# EAGLE design devboard-rs485 (EAGLE 5.11)
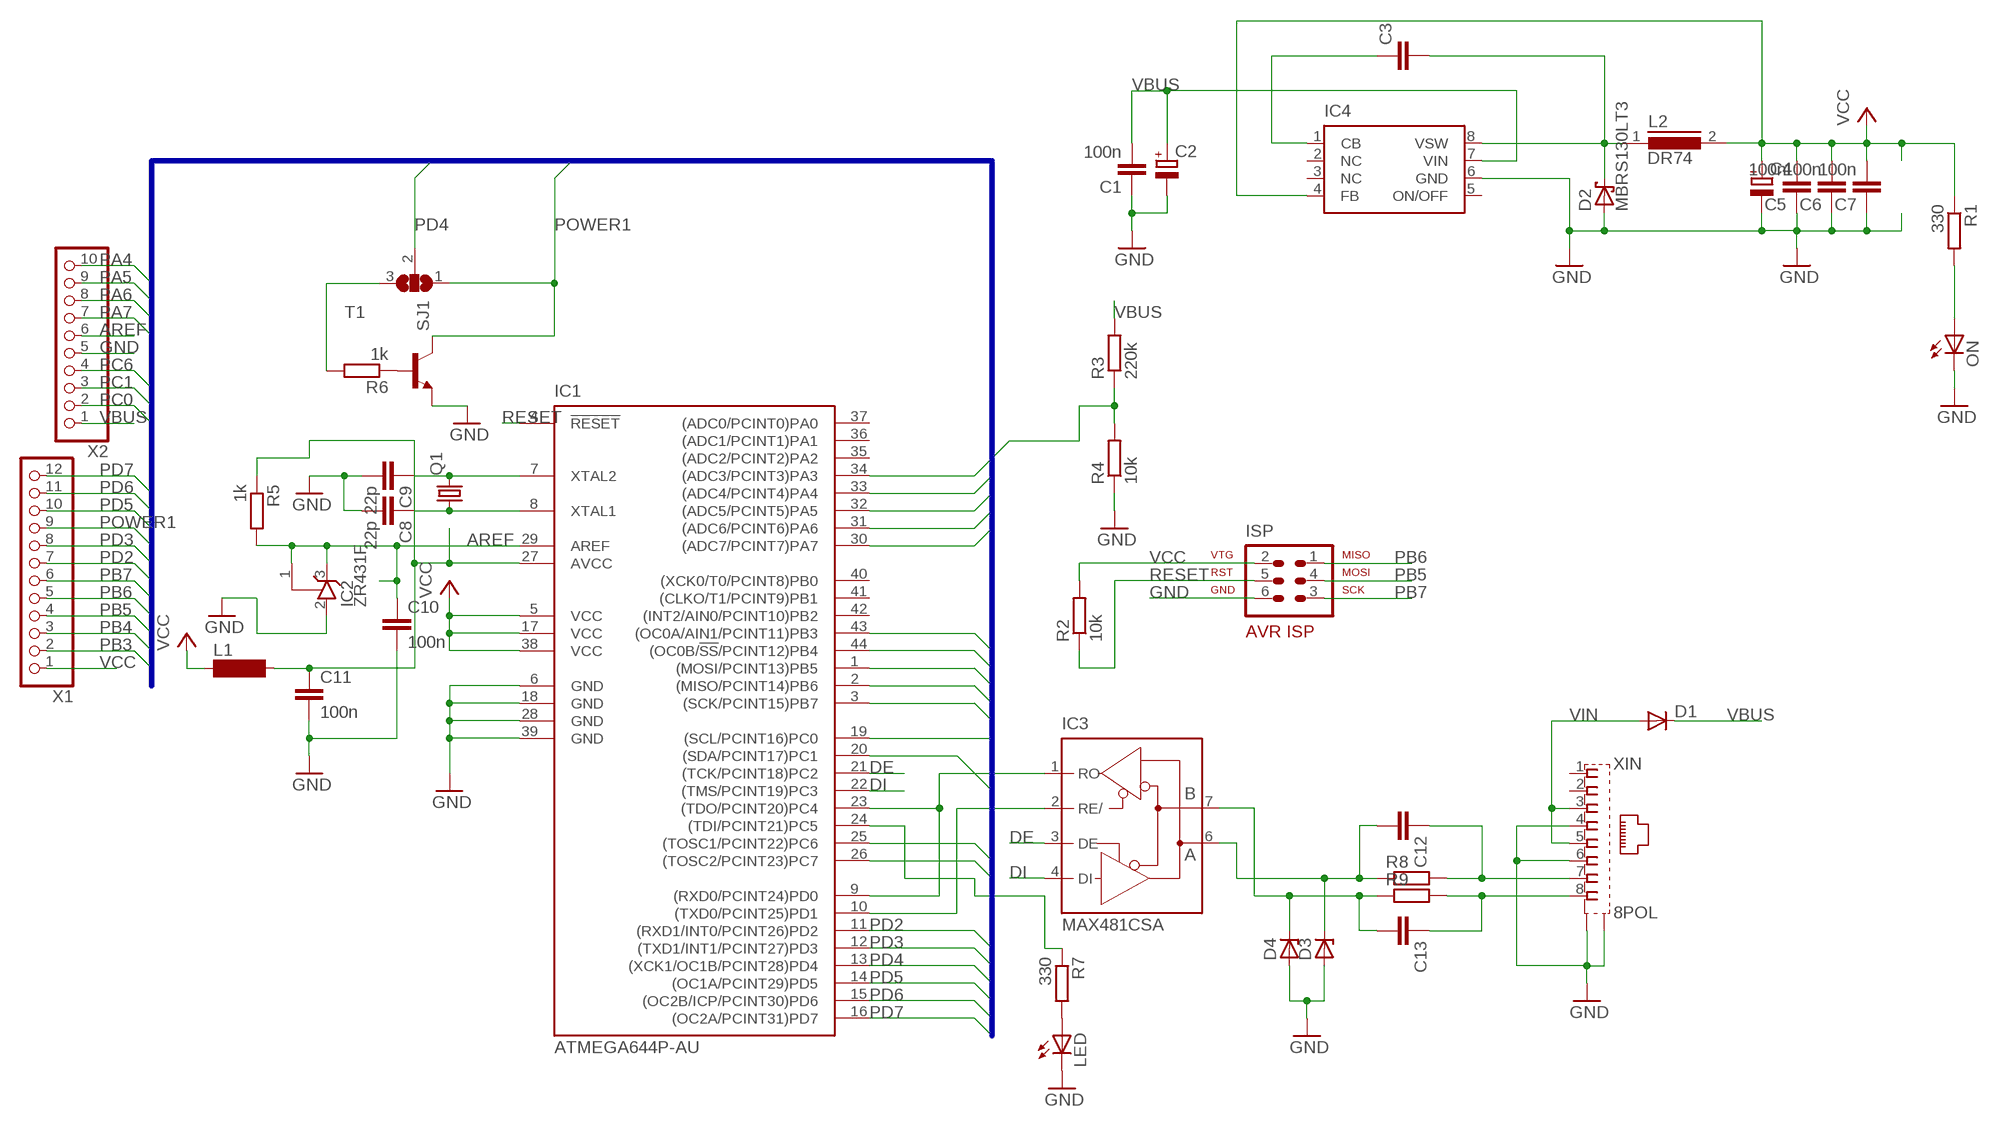
[diagram p0: schematic, sheet 1]

## Parts
C1  100n  C-EUC0805K  [C0805K]
C2  CPOL-EUE2.5-6  [E2,5-6]
C3  C-EUC0805K  [C0805K]
C4  CPOL-EUE2.5-6  [E2,5-6]
C5  100n  C-EUC0805K  [C0805K]
C6  100n  C-EUC0805K  [C0805K]
C7  100n  C-EUC0805K  [C0805K]
C8  22p  C-EUC0805K  [C0805K]
C9  22p  C-EUC0805K  [C0805K]
C10  100n  C-EUC0805K  [C0805K]
C11  100n  C-EUC0805K  [C0805K]
C12  C-EUC0805K  [C0805K]
C13  C-EUC0805K  [C0805K]
D1  DIODE-DO214BA  [DO214BA]
D2  MBRS130LT3  [SMB]
D3  ZENER-DIODESOD80C  [SOD80C]
D4  ZENER-DIODESOD80C  [SOD80C]
IC1  ATMEGA644P-AU  MEGA164P/324P/644P-AU  [TQFP44]
IC2  ZR431F  [SOT32]
IC3  MAX481CSA  [SO08]
IC4  LM2674  [SO8]
ISP  AVR-ISP-6  [AVR-ISP-6]
L1  SM-1206  [SM-1206]
L2  DR74  [DR74]
LED  LEDCHIPLED_0805  [CHIPLED_0805]
ON  LEDCHIPLED_0805  [CHIPLED_0805]
Q1  CRYSTALHC49UP  [HC49UP]
R1  330  R-EU_R0805  [R0805]
R2  10k  R-EU_R0805  [R0805]
R3  220k  R-EU_R0805  [R0805]
R4  10k  R-EU_R0805  [R0805]
R5  1k  R-EU_R0805  [R0805]
R6  1k  R-EU_R0805  [R0805]
R7  330  R-EU_R0805  [R0805]
R8  R-EU_R0805  [R0805]
R9  R-EU_R0805  [R0805]
SJ1  SJ2W  [SJ_2]
T1  MMBT2222ALT1-NPN-SOT23-BEC  [SOT23-BEC]
X1  PINHD-1X12  [1X12]
X2  PINHD-1X10  [1X10]
XIN  8POL  [8POL]

## Nets
AREF: C10.1 IC1.29(AREF) IC2.1(R) IC2.3(C) R5.2 X2.6
AVCC: C11.1 IC1.27(AVCC) L1.2 R5.1
DE: IC1.21((TCK/PCINT18)PC2) IC3.3(DE)
DI: IC1.22((TMS/PCINT19)PC3) IC3.4(DI)
GND: C1.1 C2.- C4.- C5.1 C6.1 C7.1 C8.2 C9.2 C10.2 C11.2 D2.A D3.A D4.A IC1.6(GND) IC1.18(GND) IC1.28(GND) IC1.39(GND) IC2.2(A) IC4.6(GND) ISP.6 LED.C ON.C R4.1 T1.E X2.5 XIN.4 XIN.6 XIN.S1 XIN.S2
N$1: C8.1 IC1.8(XTAL1) Q1.1
N$2: C9.1 IC1.7(XTAL2) Q1.2
N$3: IC1.9((RXD0/PCINT24)PD0) IC1.23((TDO/PCINT20)PC4) IC3.1(RO)
N$4: IC1.10((TXD0/PCINT25)PD1) IC3.2(RE/)
N$5: LED.A R7.2
N$9: C3.2 D2.C IC4.8(VSW) L2.1
N$10: C3.1 IC4.1(CB)
N$11: C12.2 D3.C IC3.6(A) R8.1
N$12: R6.2 SJ1.3
N$13: C13.2 D4.C IC3.7(B) R9.1
N$15: C12.1 R8.2 XIN.7
N$16: C13.1 R9.2 XIN.8
N$20: R6.1 T1.B
N$21: ON.A R1.2
N$22: IC1.24((TDI/PCINT21)PC5) R7.1
PA3: IC1.34((ADC3/PCINT3)PA3) R3.1 R4.2
PA4: IC1.33((ADC4/PCINT4)PA4) X2.10
PA5: IC1.32((ADC5/PCINT5)PA5) X2.9
PA6: IC1.31((ADC6/PCINT6)PA6) X2.8
PA7: IC1.30((ADC7/PCINT7)PA7) X2.7
PB3: IC1.43((OC0A/AIN1/PCINT11)PB3) X1.2
PB4: IC1.44((OC0B/!SS!/PCINT12)PB4) X1.3
PB5: IC1.1((MOSI/PCINT13)PB5) ISP.4 X1.4
PB6: IC1.2((MISO/PCINT14)PB6) ISP.1 X1.5
PB7: IC1.3((SCK/PCINT15)PB7) ISP.3 X1.6
PC0: IC1.19((SCL/PCINT16)PC0) X2.2
PC1: IC1.20((SDA/PCINT17)PC1) X2.3
PC6: IC1.25((TOSC1/PCINT22)PC6) X2.4
PC7: IC1.26((TOSC2/PCINT23)PC7)
PD2: IC1.11((RXD1/INT0/PCINT26)PD2) X1.7
PD3: IC1.12((TXD1/INT1/PCINT27)PD3) X1.8
PD4: IC1.13((XCK1/OC1B/PCINT28)PD4) SJ1.2
PD5: IC1.14((OC1A/PCINT29)PD5) X1.10
PD6: IC1.15((OC2B/ICP/PCINT30)PD6) X1.11
PD7: IC1.16((OC2A/PCINT31)PD7) X1.12
POWER1: SJ1.1 T1.C X1.9
RESET: IC1.4(!RESET) ISP.5 R2.1
VBUS: C1.2 C2.+ D1.C IC4.7(VIN) R3.2 X2.1
VCC: C4.+ C5.2 C6.2 C7.2 IC1.5(VCC) IC1.17(VCC) IC1.38(VCC) IC4.4(FB) ISP.2 L1.1 L2.2 R1.1 R2.2 X1.1
VIN: D1.A XIN.3 XIN.5
Unconnected: IC1.35((ADC2/PCINT2)PA2) IC1.36((ADC1/PCINT1)PA1) IC1.37((ADC0/PCINT0)PA0) IC1.40((XCK0/T0/PCINT8)PB0) IC1.41((CLKO/T1/PCINT9)PB1) IC1.42((INT2/AIN0/PCINT10)PB2) IC4.2(NC) IC4.3(NC) IC4.5(ON/OFF) XIN.1 XIN.2

## Buses
PA[0..7],PB[0..7],PC[0..7],PD[0..7],POWER1,POWER2

## Power pins joined to a net without a drawn wire
GND: IC3.5(GND)
VCC: IC3.8(VCC)

## Library data of the parts
C1 C3 C5-C13 = rcl:C-EU: CAPACITOR, European symbol
C2 C4 = rcl:CPOL-EU: POLARIZED CAPACITOR, European symbol
D1 = diode:DIODE-: DIODE
D2 = diode:MBRS130LT3: Schottky Power Rectifier Source: http://www.onsemi.com/pub/Collateral/MBRS130LT3-D.PDF
D3 D4 = diode:ZENER-DIODE: Z-Diode
IC1 = avr-6:MEGA164P/324P/644P-AU
IC2 = zr431:ZR431F
IC3 = maxim:MAX481CSA: RS485 TRANSEIVER; MF: MAXIM; MPN: MAX481CSA; OC_FARNELL: unknown; OC_NEWARK: 90C3817
IC4 = lm2674:LM2674
ISP = avr-6:AVR-ISP-6: AVR ISP-6 Serial Programming Header
L1 = inductor-neosid:SM-1206: INDUCTOR SMD chip inductor; OC_FARNELL: unknown; OC_NEWARK: unknown
L2 = inductors:DR74: High Power Density, High Efficiency, Shielded Inductors Source: coiltronics_dr_series.pdf
LED ON = led:LED: LED OSRAM: - CHIPLED LG R971, LG N971, LY N971, LG Q971, LY Q971, LO R971, LY R971 LH N974, LH R974 LS Q976, LO Q976, LY Q976 LO Q996 - Hyper CHIPLED LW Q18S LB Q993, LB Q99A, LB R99A - SideLED LS A670, LO A670, LY A670, LG A670, LP A670 LB A673, LV A673, LT A673, LW A673 LH A674 LY A675 LS A676, LA A676, LO A676, LY A676, LW A676 LS A679, LY A679, LG A679 - Hyper Micro SIDELED® LS Y876, LA Y876, LO Y876, LY Y876 LT Y87S - SmartLED LW L88C, LW L88S LB L89C, LB L89S, LG L890 LS L89K, LO L89K, LY L89K LS L896, LA L896, LO L896, LY L896 - TOPLED LS T670, LO T670, LY T670, LG T670, LP T670 LSG T670, LSP T670, LSY T670, LOP T670, LYG T670 LG T671, LOG T671, LSG T671 LB T673, LV T673, LT T673, LW T673 LH T674 LS T676, LA T676, LO T676, LY T676, LB T676, LH T676, LSB T676, LW T676 LB T67C, LV T67C, LT T67C, LS T67K, LO T67K, LY T67K, LW E67C LS E67B, LA E67B, LO E67B, LY E67B, LB E67C, LV E67C, LT E67C LW T67C LS T679, LY T679, LG T679 LS T770, LO T770, LY T770, LG T770, LP T770 LB T773, LV T773, LT T773, LW T773 LH T774 LS E675, LA E675, LY E675, LS T675 LS T776, LA T776, LO T776, LY T776, LB T776 LHGB T686 LT T68C, LB T68C - Hyper Mini TOPLED® LB M676 - Mini TOPLED Santana® LG M470 LS M47K, LO M47K, LY M47K Source: http://www.osram.convergy.de LUXEON: - LUMILED® LXK2-PW12-R00, LXK2-PW12-S00, LXK2-PW14-U00, LXK2-PW14-V00 LXK2-PM12-R00, LXK2-PM12-S00, LXK2-PM14-U00 LXK2-PE12-Q00, LXK2-PE12-R00, LXK2-PE12-S00, LXK2-PE14-T00, LXK2-PE14-U00 LXK2-PB12-K00, LXK2-PB12-L00, LXK2-PB12-M00, LXK2-PB14-N00, LXK2-PB14-P00, LXK2-PB14-Q00 LXK2-PR12-L00, LXK2-PR12-M00, LXK2-PR14-Q00, LXK2-PR14-R00 LXK2-PD12-Q00, LXK2-PD12-R00, LXK2-PD12-S00 LXK2-PH12-R00, LXK2-PH12-S00 LXK2-PL12-P00, LXK2-PL12-Q00, LXK2-PL12-R00 Source: www.luxeon.com KINGBRIGHT: KA-3528ASYC Source: www.kingbright.com
Q1 = crystal:CRYSTAL: CRYSTAL; OC_FARNELL: unknown; OC_NEWARK: unknown
R1-R9 = rcl:R-EU_: RESISTOR, European symbol
SJ1 = jumper:SJ2W: SMD solder JUMPER
T1 = transistor:*-NPN-: NPN Transistror BF959 corrected 2008.03.06
X1 = pinhead:PINHD-1X12: PIN HEADER
X2 = pinhead:PINHD-1X10: PIN HEADER
XIN = con-amp:8POL

## Board
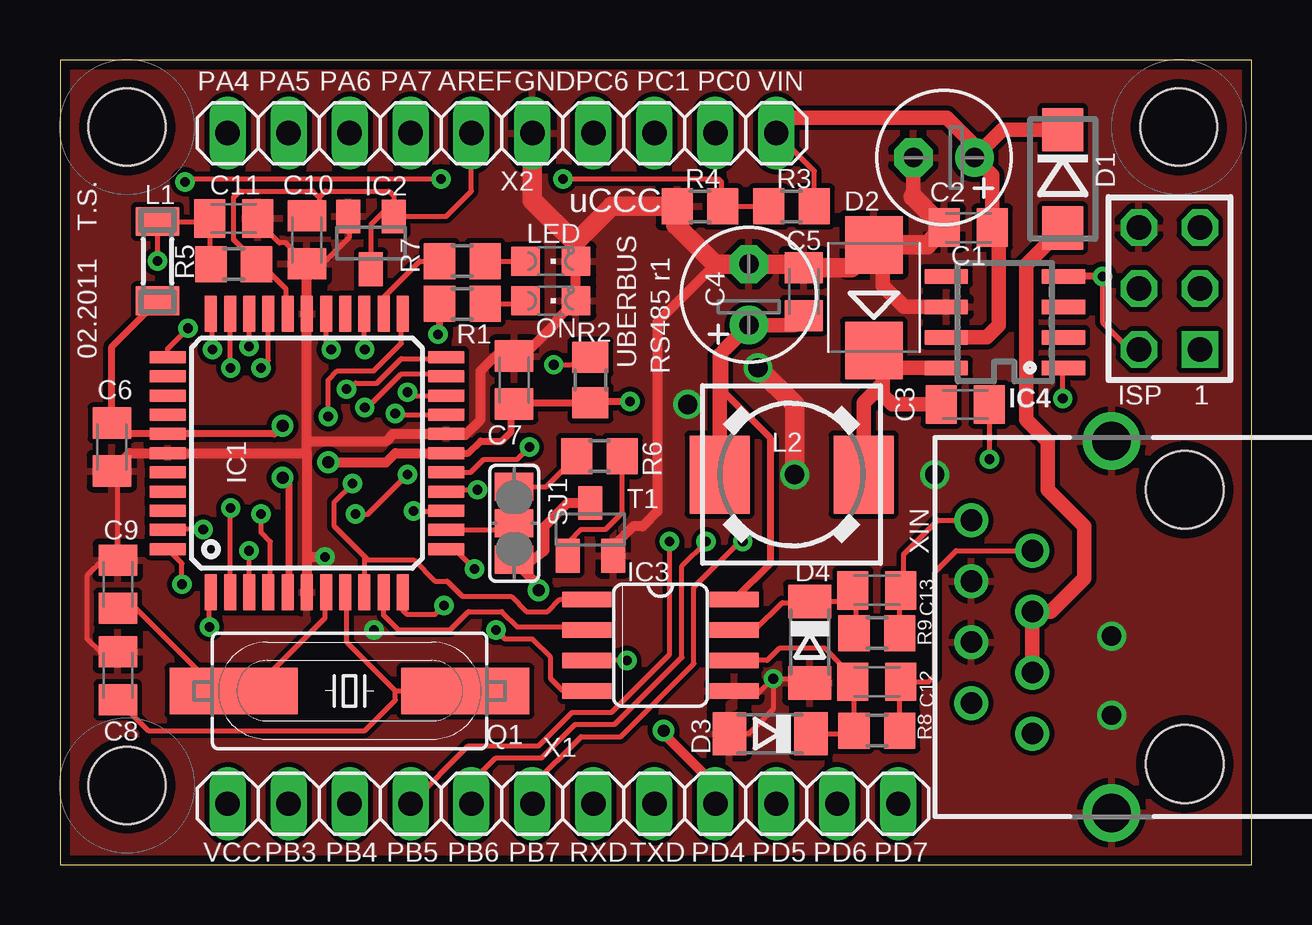
[diagram p1: board, top side]
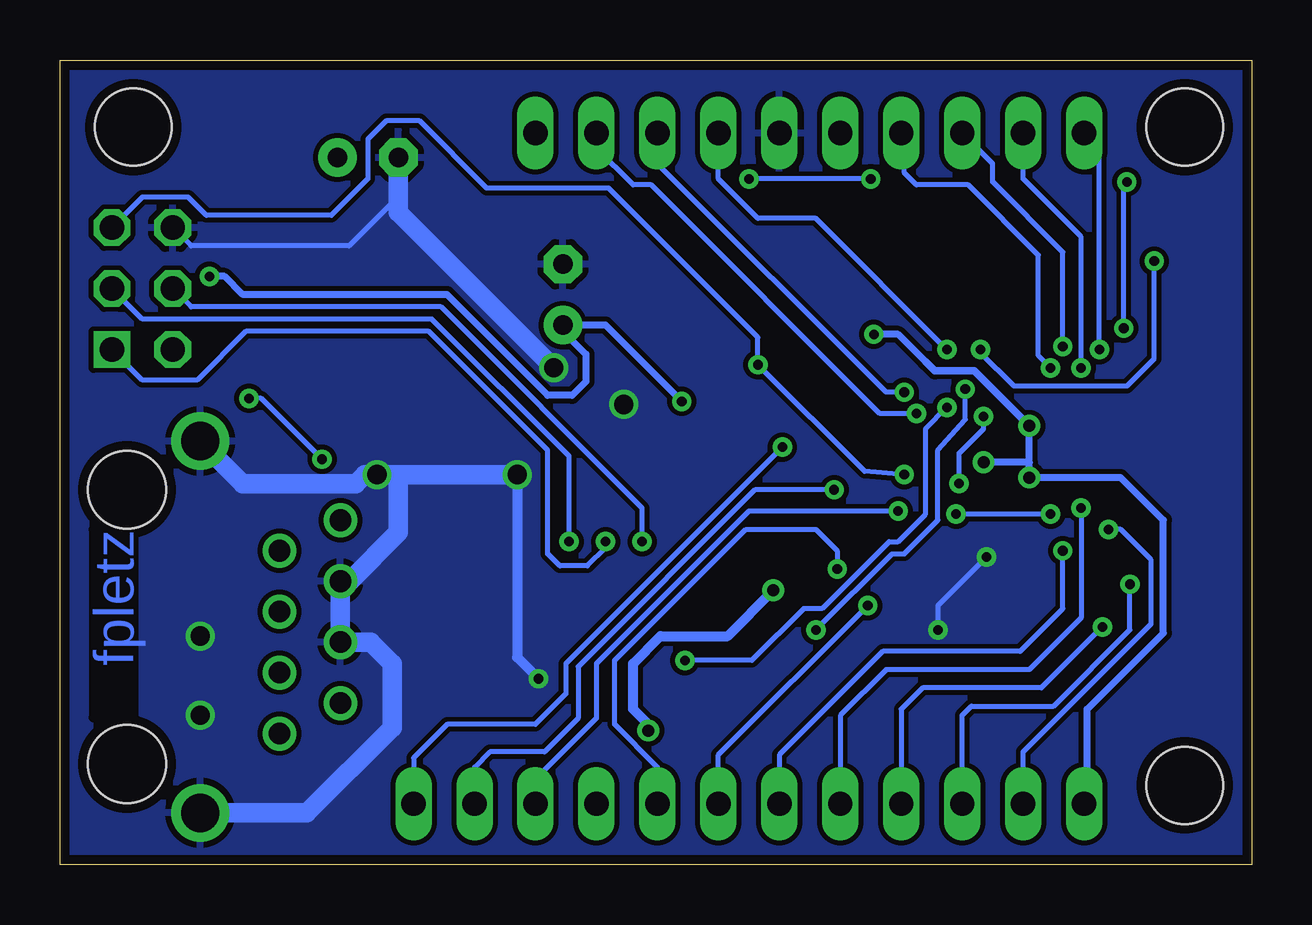
[diagram p2: board, bottom side, seen from below]

Size 49.66 x 33.53 mm. Coordinates in mm from the lower left corner, seen from the top.
Outline: 0,0 49.66,0 49.66,33.53 0,33.53 0,0
Copper layers (1*16): Top 0.035mm / dielectric 1.5mm / Bottom 0.035mm
Design rules "default *": minimum track width 0.2mm, minimum drill 0.4mm, track to track 8mil, track to pad 8mil, pad to pad 8mil, via to via 8mil, smd to smd 2mil, copper to edge 0.4mm, drill to drill 8mil, minimum pad ring 10mil, minimum via ring 8mil, stop-mask expansion 4mil, vias tented up to drill 0mil, thermal gap 10mil
Holes 3.2 mm at 2.79,3.3 2.79,30.73 46.61,30.73

### Footprints (pad centres in the part's own frame; a part is rotated, then mirrored left to right if it is on the bottom)
C0805K = smd 1.3 x 1.6: 1 -1,0; 2 1,0
E2,5-6 = drill 0.813 pad 1.6 round: + -1.27,0 | drill 0.813 pad 1.6 octagon: - 1.27,0
DO214BA = smd 1.8 x 1.7: A 2.05,0; C -2.05,0
SMB = smd 2.4 x 2.4: A 2.2,0; C -2.2,0
SOD80C = smd 1.4 x 1.8: A 1.7,0; C -1.7,0
TQFP44 = smd 1.5 x 0.5: 1 -5.8,4; 2 -5.8,3.2; 3 -5.8,2.4; 4 -5.8,1.6; 5 -5.8,0.8; 6 -5.8,0; 7 -5.8,-0.8; 8 -5.8,-1.6; 9 -5.8,-2.4; 10 -5.8,-3.2; 11 -5.8,-4; 23 5.8,-4; 24 5.8,-3.2; 25 5.8,-2.4; 26 5.8,-1.6; 27 5.8,-0.8; 28 5.8,0; 29 5.8,0.8; 30 5.8,1.6; 31 5.8,2.4; 32 5.8,3.2; 33 5.8,4 | smd 0.5 x 1.5: 12 -4,-5.8; 13 -3.2,-5.8; 14 -2.4,-5.8; 15 -1.6,-5.8; 16 -0.8,-5.8; 17 0,-5.8; 18 0.8,-5.8; 19 1.6,-5.8; 20 2.4,-5.8; 21 3.2,-5.8; 22 4,-5.8; 34 4,5.8; 35 3.2,5.8; 36 2.4,5.8; 37 1.6,5.8; 38 0.8,5.8; 39 0,5.8; 40 -0.8,5.8; 41 -1.6,5.8; 42 -2.4,5.8; 43 -3.2,5.8; 44 -4,5.8
SOT32 = smd 1 x 1.4: 1 -0.95,-1.1; 2 0.95,-1.1; 3 0,1.1
SO08 = smd 0.66 x 2.032: 1 -1.905,-3.073; 2 -0.635,-3.073; 3 0.635,-3.073; 4 1.905,-3.073; 5 1.905,3.073; 6 0.635,3.073; 7 -0.635,3.073; 8 -1.905,3.073
SO8 = smd 0.6 x 1.8: 1 -1.905,-2.44; 2 -0.635,-2.44; 3 0.635,-2.44; 4 1.905,-2.44; 5 1.905,2.44; 6 0.635,2.44; 7 -0.635,2.44; 8 -1.905,2.44
AVR-ISP-6 = drill 1.016 square: 1 -2.54,-1.27 | drill 1.016 octagon: 2 -2.54,1.27; 3 0,-1.27; 4 0,1.27; 5 2.54,-1.27; 6 2.54,1.27
SM-1206 = smd 1.2 x 1.8: 1 -1.65,0; 2 1.65,0
DR74 = smd 2.5 x 3.25: 1 -3,0; 2 3,0
CHIPLED_0805 = smd 1.2 x 1.2: A 0,-1.05; C 0,1.05
HC49UP = smd 5.334 x 1.93: 1 -4.826,0; 2 4.826,0
R0805 = smd 1.3 x 1.5: 1 -0.95,0; 2 0.95,0
SJ_2 = smd 1.168 x 1.6: 1 -1.524,0; 2 0,0; 3 1.524,0
SOT23-BEC = smd 1 x 1.4: B -0.95,-1.1; C 0,1.1; E 0.95,-1.1
1X12 = drill 1.016 long: 1 -13.97,0; 2 -11.43,0; 3 -8.89,0; 4 -6.35,0; 5 -3.81,0; 6 -1.27,0; 7 1.27,0; 8 3.81,0; 9 6.35,0; 10 8.89,0; 11 11.43,0; 12 13.97,0
1X10 = drill 1.016 long: 1 -11.43,0; 2 -8.89,0; 3 -6.35,0; 4 -3.81,0; 5 -1.27,0; 6 1.27,0; 7 3.81,0; 8 6.35,0; 9 8.89,0; 10 11.43,0
8POL = drill 0.9 round: 1 -4.445,6.35; 2 -3.175,8.89; 3 -1.905,6.35; 4 -0.635,8.89; 5 0.635,6.35; 6 1.905,8.89; 7 3.175,6.35; 8 4.445,8.89 | drill 1.6 round: S1 -7.745,3.05; S2 7.745,3.05 | hole 3.25: -5.715,0; 5.715,0

### Placement (x,y rotation side)
C1  37.85,26.54 0 top
C2  36.83,29.46 180 top
C3  37.72,19.18 180 top
C4  28.7,23.75 90 top
C5  30.99,23.88 270 top
C6  2.16,17.4 90 top
C7  18.92,20.19 270 top
C8  2.41,7.87 90 top
C9  2.41,11.68 90 top
C10  10.29,26.04 270 top
C11  7.24,26.92 0 top
C12  34.04,7.62 180 top
C13  34.04,11.43 180 top
D1  41.78,28.57 270 top
D2  33.91,23.62 90 top
D3  29.59,5.46 180 top
D4  31.24,9.27 270 top
IC1  10.29,17.14 90 top
IC2  12.95,25.91 180 top
IC3  25.02,9.14 270 top
IC4  39.37,22.61 90 top
ISP  46.23,24 90 top
L1  4.06,25.15 90 top
L2  30.48,16.26 180 top
LED  20.45,25.15 270 top
ON  20.45,23.5 270 top
Q1  12.06,7.24 180 top
R1  16.76,23.37 0 top
R2  22.1,20.19 270 top
R3  30.48,27.43 0 top
R4  26.67,27.43 0 top
R5  7.24,25.02 0 top
R6  22.48,17.02 180 top
R7  16.76,25.15 0 top
R8  34.04,5.59 0 top
R9  34.04,9.65 0 top
SJ1  18.92,14.22 90 top
T1  22.1,13.97 0 top
X1  20.95,2.54 0 top
X2  18.41,30.48 180 top
XIN  46.86,9.91 90 top

### Tracks (layer width: path | path; a pad name or v marks a point on that pad's centre or on a via)
AREF
  Top 0.2: IC1.29 9.4,23.03 9.4,24 8.32,25.09 R5.2 8.13,25.15 7.24,26.04 7.24,27.81 7.49,28.07 10.54,28.07 10.79,27.81 | C10.1 10.54,27.43 | C10.1 10.64,27.26 | C10.1 10.79,27.42 10.79,27.81 | IC2.1 13.55,27.26 12.95,26.67 IC2.3 | IC2.1 13.9,27.88 13.72,28.07 11.05,28.07 10.79,27.81 | 17.14,29.08 X2.6 17.14,28.07 16.09,27.01 IC2.1
AVCC  (via drill 0.4)
  Top 0.2: C11.1 5.98,26.8 L1.2 v4.06,25.15 | C11.1 6.42,26.87 | R5.1 6.24,25.2 C11.1 | IC1.27 11.09,21.68 v11.3,21.46
  Bottom 0.2: v4.06,25.15 4.06,21.08 5.21,19.94 9.91,19.94 11.3,21.34 v11.3,21.46
DE  (via drill 0.4)
  Top 0.2: 16.11,20.32 IC1.21 arc90 15.98,20.45 14.22,20.45 12.83,19.05 v12.7,19.05 | v23.62,8.51 IC3.3
  Bottom 0.2: v23.62,8.51 20.83,8.51 18.67,10.67 17.91,10.67 15.11,13.46 14.73,13.46 13.59,14.61 13.59,18.16 v12.7,19.05
DI  (via drill 0.4)
  Top 0.2: 21.82,7.37 IC3.4 20.95,7.24 20.45,7.75 20.45,8.64 19.68,9.4 18.54,9.4 v18.16,9.78 | IC1.22 16.02,21.08 14.22,21.08 13.21,20.07 12.32,20.07 v11.94,19.81
  Bottom 0.2: v18.16,9.78 14.99,12.95 14.48,12.95 13.08,14.35 13.08,17.27 11.94,18.54 v11.94,19.81
GND  (via drill 0.4, 0.8)
  Top 0.2: R4.1 25.65,27.37 | 30.66,7.24 D4.A 30.81,7.75 v29.72,7.75 | D3.A 28.7,5.46 29.72,6.48 v29.72,7.75 | IC3.5 27.96,7.11 29.08,7.11 v29.72,7.75 | C11.2 8.38,27.05 8.38,26.67 9.14,25.91 9.41,25.91 C10.2 11.06,25.16 12.06,26.16 12.06,27.07 IC2.2 | 19.29,21.19 C7.1 18.14,21.19 | 16.89,17.91 16.12,17.91 IC1.18 | LED.C 21.59,25.15 | T1.E 23.05,12.64 | C6.1 2.41,16.14 C9.2 2.3,12.57 1.65,12.57 1.14,12.06 1.14,9.4 1.65,8.89 2.4,8.89 C8.2
  Top 0.3: 25.65,27.37 25.65,26.67
  Top 0.406: C10.2 IC1.28 10.29,17.53 | 10.29,17.14 IC1.39 2.9,17.14 C6.1 | 10.29,17.14 10.29,17.53 | 10.29,12.83 IC1.6 | 10.29,17.14 10.29,12.83 | 19.29,21.19 20.7,22.61 20.7,22.7 ON.C LED.C 21.46,25.18 21.46,25.91 | 18.14,21.19 17.53,20.57 17.53,18.54 16.89,17.91 | T1.E 23.05,13.27 23.88,14.1 24.27,14.1 24.89,14.72 24.89,22.61 27.3,25.02 | 10.29,12.83 v11.05,12.83 | IC1.18 13.88,17.95 13.59,17.65 10.41,17.65 10.29,17.53
  Top 0.61: 35.56,27.83 C2.- | D2.A 33.17,25.82 | 32.96,24.88 D2.A | 30.84,25.02 C5.1 | IC4.6 35.18,23.24 34.29,24.13 34.29,25.44 D2.A
  Top 0.813: 35.56,27.83 C1.1 36.12,25.82 D2.A | C5.1 32.96,24.88 | 30.84,25.02 C4.- 27.3,25.02 25.65,26.67 | v30.61,16.26 30.61,19.18 v29.08,20.7 | X2.5 19.68,27.69 21.46,25.91 22.99,27.43 R4.1
  Bottom 0.2: C2.- 35.56,27.83 37.61,25.78 44.2,25.78 ISP.6 | v13.08,9.78 13.08,10.79 v11.05,12.83 | v36.45,16.26 35.56,16.13
  Bottom 0.406: v29.72,7.75 30.61,8.64 v30.61,16.26
  Bottom 0.61: v36.45,16.26 35.69,16.26 35.56,16.13
  Bottom 0.813: v30.61,16.26 v36.45,16.26 36.96,16.26 37.34,15.88 42.04,15.88 XIN.S2 | v29.08,20.7 35.56,27.18 C2.- | 35.56,16.13 35.56,13.84 37.59,11.81 XIN.6 XIN.4 36.7,9.27 35.81,8.38 35.81,5.71 39.37,2.16 XIN.S1
  other vias: 43.81,6.22 43.81,9.53 26.16,19.18
  pour Bottom: -1.02,34.29 -1.4,-0.76 51.31,-0.89 51.18,34.42 47.24,34.42
  pour Top: -1.02,34.29 -1.02,-0.51 51.31,-0.89 51.18,34.42 47.24,34.42
N$1
  Top 0.2: IC1.8 11.94,11.29 11.94,9.27 13.97,7.24 | Q1.1 17,7.24 | Q1.1 16.89,7.13 | 13.97,7.24 Q1.1 | 13.97,7.24 13.97,6.86 12.7,5.59 3.68,5.59 2.41,6.86 C8.1
N$2
  Top 0.2: IC1.7 11.05,11.31 11.05,10.29 8,7.24 Q1.2 6.86,7.62 6.22,7.62 3.16,10.68 C9.1
N$3  (via drill 0.4)
  Top 0.2: 12.57,11.46 IC1.9 12.7,11.36 12.7,12.83 | 12.7,12.83 11.43,14.1 11.43,15.11 v12.19,15.88 | 12.7,12.83 12.83,12.7 14.73,12.7 15.62,11.81 16.13,11.81 16.76,11.18 18.8,11.18 19.43,10.54 20.32,10.54 20.83,11.05 IC3.1 | v11.18,18.67 11.18,20.19 11.56,20.57 13.08,20.57 14.22,21.72 14.22,22.88 IC1.23
  Bottom 0.2: v12.19,15.88 12.19,17.14 11.18,18.16 v11.18,18.67
N$4
  Top 0.2: IC1.10 13.49,10.39 14.1,9.78 16.26,9.78 17.02,10.54 18.41,10.54 19.05,9.91 21.82,9.91 IC3.2
N$5
  Top 0.2: R7.2 LED.A
N$9
  Top 0.61: IC4.8 34.63,20.7 D2.C 34.29,21.04 34.29,20.07 | C3.2 34.67,19.18 34.29,19.56 34.29,20.07 | L2.1 33.48,19.26 34.29,20.07
N$10  (via drill 0.4)
  Top 0.2: v41.78,19.43 41.78,20.67 IC4.1 | v38.73,16.89 38.73,18.91 C3.1
  Bottom 0.2: v38.73,16.89 41.27,19.43 v41.78,19.43
N$11
  Top 0.2: C12.2 33.34,7.44 | IC3.6 29.46,8.51 29.97,9.02 31.88,9.02 32.64,8.26 32.66,8.26 C12.2 | C12.2 33.15,7.49 | D3.C 33.21,5.46 R8.1 33.09,7.57 C12.2
N$12
  Top 0.2: SJ1.3 20.26,15.75 R6.2
N$13
  Top 0.2: IC3.7 28.96,9.78 30.1,10.92 30.94,10.92 D4.C 32.83,10.97 | 32.83,10.97 C13.2 | R9.1 33.16,9.45 33.16,10.64 32.83,10.97
N$15
  Top 0.2: C12.1 35.24,7.44 | XIN.7 37.34,13.08 36.45,12.19 36.45,7.87 36.2,7.62 C12.1 | R8.2 34.99,7.57 C12.1
N$16
  Top 0.2: C13.1 35.11,11.25 | XIN.8 36.58,14.35 35.16,12.94 35.16,11.56 C13.1 | R9.2 34.99,11.38 C13.1
N$20
  Top 0.2: R6.1 23.43,14.67 22.73,13.97 21.72,13.97 21.21,13.46 21.21,12.93 T1.B
N$21
  Top 0.2: R1.2 19.27,23.37 ON.A
N$22
  Top 0.2: 16.32,25.15 R7.1 14.99,25.15 13.49,23.65 IC1.24
PA3  (via drill 0.4)
  Top 0.2: R3.1 R4.2 27.56,27.49 27.56,28.45 27.43,28.57 v20.95,28.57 | IC1.34 4.49,21.5 v5.33,22.35 | v5.21,28.45 5.46,28.57 v15.88,28.57
  Bottom 0.2: v5.33,22.35 5.33,28.32 v5.21,28.45 | v15.88,28.57 v20.95,28.57
PA4  (via drill 0.4)
  Top 0.2: IC1.33 6.35,22.88 v6.35,21.46
  Bottom 0.2: v6.35,21.46 6.35,29.84 X2.10
PA5  (via drill 0.4)
  Top 0.2: IC1.32 7.09,20.85 v7.11,20.7
  Bottom 0.2: v7.11,20.7 7.11,26.16 9.53,28.57 X2.9
PA6  (via drill 0.4)
  Top 0.2: IC1.31 7.89,21.6 v7.87,21.59
  Bottom 0.2: v7.87,21.59 7.87,25.53 10.79,28.45 10.79,29.21 X2.8
PA7  (via drill 0.4)
  Top 0.2: IC1.30 8.69,21.01 v8.38,20.7
  Bottom 0.2: v8.38,20.7 8.89,21.21 8.89,25.4 11.81,28.32 13.97,28.32 14.48,28.83 14.48,30.35 X2.7
PB3  (via drill 0.4)
  Top 0.2: IC1.43 4.51,13.97 v5.97,13.97
  Bottom 0.2: X1.2 9.53,4.7 4.19,10.03 4.19,12.7 5.46,13.97 v5.97,13.97
PB4  (via drill 0.4)
  Top 0.2: v5.08,11.68 5.08,12.55 IC1.44
  Bottom 0.2: X1.3 12.06,6.22 11.68,6.6 8.26,6.6 5.08,9.78 v5.08,11.68
PB5  (via drill 0.4)
  Top 0.2: IC1.1 6.22,11.28 v6.22,9.91 | X1.4 17.02,4.95 19.94,4.95 21.34,6.35 22.99,6.35 25.4,8.76 v25.4,13.46
  Bottom 0.2: X1.4 14.61,6.48 13.72,7.37 8.76,7.37 v6.22,9.91 | ISP.4 44.2,23.24 33.78,23.24 25.4,14.86 v25.4,13.46
PB6  (via drill 0.4)
  Top 0.2: IC1.2 7.09,14.45 7.11,14.48 v7.11,14.86 | X1.5 17.14,3.43 18.16,4.45 20.07,4.45 21.46,5.84 23.11,5.84 25.91,8.64 25.91,12.45 v26.92,13.46
  Bottom 0.2: v7.11,14.86 7.11,10.29 9.27,8.13 15.24,8.13 17.14,6.22 X1.5 | v26.92,13.46 26.92,13.21 27.69,12.45 28.83,12.45 29.34,12.95 29.34,17.27 34.29,22.23 41.91,22.23 43.94,20.19 46.23,20.19 ISP.1
PB7  (via drill 0.4)
  Top 0.2: IC1.3 7.87,11.36 v7.87,13.08 | X1.6 19.68,3.3 21.72,5.33 23.37,5.33 26.42,8.38 26.42,11.56 28.32,13.46 v28.45,13.46
  Bottom 0.2: v7.87,13.08 7.87,10.67 9.65,8.89 15.37,8.89 19.68,4.57 X1.6 | v28.45,13.46 28.45,17.02 34.16,22.73 46.23,22.73 ISP.3
PC0  (via drill 0.4)
  Top 0.2: 16.01,18.67 IC1.19 14.02,18.75 v13.97,18.8
  Bottom 0.2: X2.2 27.3,29.84 25.78,28.32 25.02,28.32 15.49,18.8 v13.97,18.8
PC1  (via drill 0.4)
  Top 0.2: IC1.20 14.62,19.55 v14.48,19.68
  Bottom 0.2: X2.3 24.77,29.21 15.24,19.68 v14.48,19.68
PC6  (via drill 0.4)
  Top 0.2: IC1.25 12.69,21.35 v12.7,21.46
  Bottom 0.2: X2.4 22.23,28.57 20.57,26.92 18.16,26.92 v12.7,21.46
PD2  (via drill 0.4)
  Top 0.2: IC1.11 14.29,10.61 14.48,10.41 15.62,10.41 v16,10.79
  Bottom 0.2: X1.7 22.23,3.68 | X1.7 22.1,2.67 | v16,10.79 22.23,4.57 X1.7
PD3  (via drill 0.4)
  Top 0.2: 16.15,13.21 IC1.12 16.45,13.14 v17.27,12.32
  Bottom 0.2: X1.8 24.77,4.06 26.54,5.84 26.54,8.51 21.08,13.97 18.16,13.97 17.27,13.08 v17.27,12.32
PD4
  Top 0.2: IC1.13 18.39,13.95 SJ1.2
PD5  (via drill 0.4)
  Top 0.2: v14.73,14.73 16.07,14.73 arc90 IC1.14
  Bottom 0.2: X1.10 29.84,3.56 27.3,6.1 27.3,8.38 20.95,14.73 v14.73,14.73
PD6  (via drill 0.4)
  Top 0.2: IC1.15 16.16,15.62 v17.4,15.62
  Bottom 0.2: X1.11 32.38,4.06 31.75,4.7 29.46,4.7 28.07,6.1 28.07,8.26 20.7,15.62 v17.4,15.62
PD7  (via drill 0.4)
  Top 0.2: IC1.16 17.11,16.34 17.65,16.89 19.05,16.89 v19.56,17.4
  Bottom 0.2: v19.56,17.4 28.57,8.38 28.57,7.11 29.84,5.84 33.53,5.84 34.92,4.45 X1.12
POWER1  (via drill 0.5)
  Top 0.406: T1.C 21.17,15.07 20.19,14.1 20.19,13.08 19.68,12.7 SJ1.1 19.94,11.56 v19.94,11.43 | X1.9 27.3,3.3 25.15,5.46 v25.15,5.59
  Bottom 0.406: v19.94,11.43 21.84,9.53 24.64,9.53 25.78,8.38 25.78,6.48 25.15,5.84 v25.15,5.59
RESET  (via drill 0.4)
  Top 0.2: v20.57,20.83 21.27,20.83 R2.1 | v12.32,14.61 12.83,14.61 v14.48,16.26 | IC1.4 8.76,11.42 8.76,13.46 8.38,13.84 v8.38,14.61
  Bottom 0.2: v8.38,14.61 v12.32,14.61 | v14.48,16.26 16.13,16.38 v20.57,20.83 20.57,21.97 26.8,28.19 31.88,28.19 34.67,30.99 36.07,30.99 36.83,30.23 36.83,28.57 38.35,27.05 43.56,27.05 44.32,27.81 46.23,27.81 ISP.5
VBUS
  Top 0.2: X2.1 31.43,28.89 R3.2
  Top 0.61: D1.C 39.26,30.62 C2.+ | C2.+ 38.85,28.72 C1.2 39.12,26.27 39.12,22.48 38.61,21.97 IC4.7 | C2.+ 38.1,29.97 36.96,31.11 30.48,31.11 X2.1
VCC  (via drill 0.4, 0.5)
  Top 0.2: 9.4,11.26 IC1.5 9.53,11.38 | L1.1 | 18.8,19.07 C7.2 | R2.2 22.16,19.3 | L2.2 27.48,15.3 | 27.75,21.53 27.75,19.62 | ISP.2 44.58,21.46 43.43,22.61 v43.43,24.51
  Top 0.3: v43.43,24.51 IC4.4 | L1.1 2.16,21.59 C6.2 2.61,17.95 IC1.38 8.93,17.95 v9.27,18.29 | R1.1 15.81,22.16 v15.75,22.1 | 18.8,19.07 18.8,18.03 18.41,17.65 17.53,17.65 17.02,17.14 IC1.17 | C7.2 18.97,19.24 R2.2 | 22.16,19.3 v23.75,19.3 | IC3.8 29.59,12.55 29.59,17.78 27.75,19.62 | 9.53,11.38 9.53,15.88 v9.27,16.13
  Top 0.406: IC1.17 13.97,17.14 13.59,16.76 v11.18,16.76
  Top 0.61: L2.2 27.48,21.26 27.75,21.53 C4.+ 30.59,22.48 C5.2
  Bottom 0.3: 9.27,16.76 v9.27,16.13 5.46,16.13 3.68,14.35 3.68,9.65 6.86,6.48 6.86,2.67 X1.1 | 9.27,16.76 v9.27,18.29 | v43.43,24.51 42.8,24.51 42.04,23.75 33.53,23.75 29.34,19.56 28.32,19.56 27.75,20.13 27.75,21.27 28.7,22.23 C4.+ 26.92,22.48 v23.75,19.3 | 9.27,16.76 v11.18,16.76 | 13.59,20.95 14.73,22.1 v15.75,22.1
  Bottom 0.305: 13.59,20.95 13.21,20.57 11.56,20.57 v9.27,18.29
VIN
  Top 0.61: XIN.3 XIN.5 41.27,10.54 42.67,11.94 42.67,14.1 41.15,15.62 41.15,17.65 40.26,18.54 40.26,25 D1.A

### Text on the board
Bottom: fpletz
tPlace: PA4 | PA5 | PA6 | PA7 | AREF | GND | PC6 | PC1 | PC0 | VIN | uCCC | T.S. | 02.2011 | UBERBUS | RS485 r1 | 1 | VCC | PB3 | PB4 | PB5 | PB6 | PB7 | RXD | TXD | PD4 | PD5 | PD6 | PD7